# EAGLE design BottomButtonBoard (EAGLE 9.2.2)
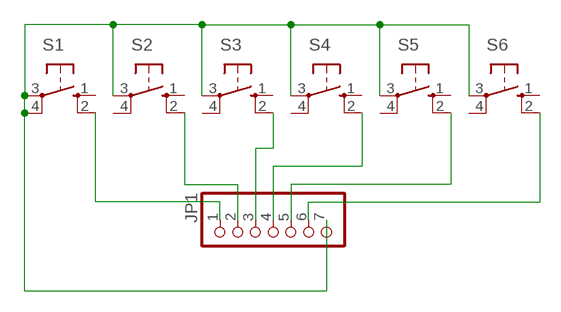
[diagram p0: schematic, sheet 1]

## Parts
JP1  PINHD-1X7  [1X07]
S1  10-XX  [B3F-10XX]
S2  10-XX  [B3F-10XX]
S3  10-XX  [B3F-10XX]
S4  10-XX  [B3F-10XX]
S5  10-XX  [B3F-10XX]
S6  10-XX  [B3F-10XX]

## Nets
N$1: JP1.1 S1.2(S1)
N$2: JP1.2 S2.2(S1)
N$3: JP1.3 S3.2(S1)
N$4: JP1.4 S4.2(S1)
N$5: JP1.5 S5.2(S1)
N$6: JP1.6 S6.2(S1)
N$7: JP1.7 S1.3(P) S1.4(P1) S2.3(P) S3.3(P) S4.3(P) S5.3(P) S6.3(P)
Unconnected: S1.1(S) S2.1(S) S2.4(P1) S3.1(S) S3.4(P1) S4.1(S) S4.4(P1) S5.1(S) S5.4(P1) S6.1(S) S6.4(P1)

## Library data of the parts
JP1 = pinhead:PINHD-1X7: PIN HEADER
S1-S6 = switch-omron:10-XX: OMRON SWITCH; MPN: B3F-1000; OC_FARNELL: 176432; OC_NEWARK: 36M3542

## Net classes
0 default: width 0.254 mm, clearance 0.203 mm

## Board
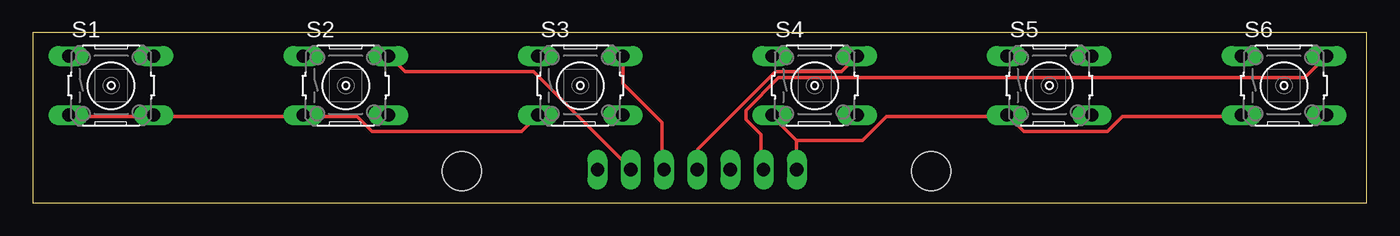
[diagram p1: board, top side]
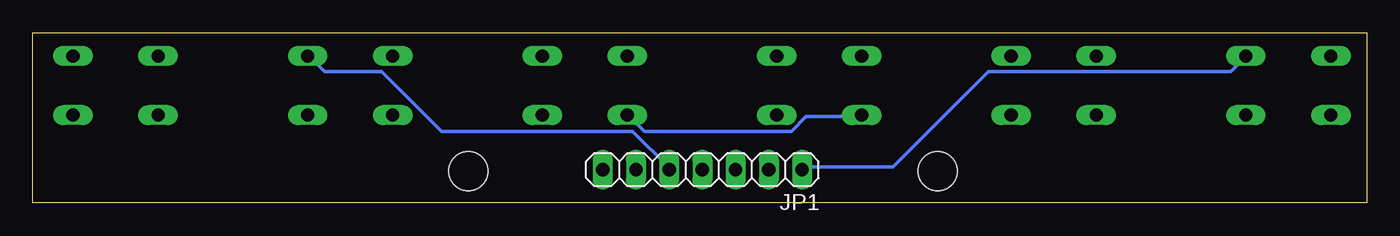
[diagram p2: board, bottom side, seen from below]

Size 102 x 13.04 mm. Coordinates in mm from the lower left corner, seen from the top.
Outline: 0,0 102,0 102,13.04 0,13.04 0,0
Copper layers (1*16): Top 0.035mm / dielectric 1.5mm / Bottom 0.035mm
Design rules "default": minimum track width 6mil, minimum drill 0.35mm, track to track 6mil, track to pad 6mil, pad to pad 6mil, via to via 6mil, smd to smd 6mil, copper to edge 40mil, drill to drill 6mil, minimum pad ring 10mil, minimum via ring 8mil, stop-mask expansion 4mil, vias tented up to drill 0mil, thermal gap 10mil
Holes 3 mm at 32.81,2.42 68.68,2.42

### Footprints (pad centres in the part's own frame; a part is rotated, then mirrored left to right if it is on the bottom)
1X07 = drill 1.016 long: 1 -7.62,0; 2 -5.08,0; 3 -2.54,0; 4 0,0; 5 2.54,0; 6 5.08,0; 7 7.62,0
B3F-10XX = drill 1.016 long: 1 -3.251,2.261; 2 3.251,2.261; 3 -3.251,-2.261; 4 3.251,-2.261

### Placement (x,y rotation side)
JP1  50.8,2.54 180 bottom
S1  6,8.98 0 top
S2  23.93,8.98 0 top
S3  41.86,8.98 0 top
S4  59.8,8.98 0 top
S5  77.73,8.98 0 top
S6  95.66,8.98 0 top

### Tracks (layer width: path | path; a pad name or v marks a point on that pad's centre or on a via)
N$1
  Bottom 0.254: JP1.1 43.09,2.74 36.23,2.74 28.92,10.06 10.4,10.06 9.26,11.2 S1.2
N$2
  Top 0.254: JP1.2 45.61,2.74 38.29,10.06 28.46,10.06 27.32,11.2 S2.2
N$3
  Top 0.254: S3.2 45.15,11.2 45.15,9.14 48.12,6.17 48.12,2.74 JP1.3
N$4
  Top 0.254: JP1.4 50.86,2.74 50.86,4.12 56.81,10.06 61.84,10.06 62.98,11.2 S4.2
N$5
  Bottom 0.254: JP1.5 53.38,2.74 56.12,5.49 70.75,5.49 75.32,10.06 79.67,10.06 80.81,11.2 S5.2
N$6
  Top 0.254: JP1.6 55.66,2.74 55.66,5.26 54.52,6.4 54.52,7.09 57.04,9.6 97.27,9.6 98.87,11.2 S6.2
N$7
  Top 0.254: S1.3 2.86,6.63 9.03,6.63 S1.4 9.26,6.63 20.46,6.63 S2.3 20.69,6.63 24.8,6.63 25.95,5.49 37.38,5.49 38.52,6.63 S3.3 | 58.41,4.8 58.41,2.74 JP1.7 | 58.41,4.8 56.58,6.63 S4.3 | 58.41,4.8 63.44,4.8 65.27,6.63 74.41,6.63 S5.3 74.64,6.63 75.78,5.49 82.18,5.49 83.33,6.63 92.24,6.63 S6.3
  Bottom 0.254: S3.3 38.75,6.63 42.86,6.63 44.01,5.49 55.21,5.49 56.35,6.63 S4.3